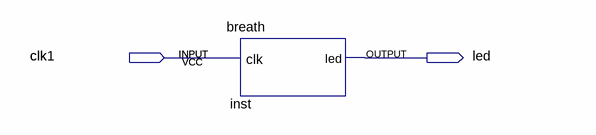
[diagram p0: schematic sheet]
// Quartus schematic Block5.bdf as structural Verilog: 1 symbols, 3 pins
module Block5 (
  input  clk,
  input  clk1,
  output led
);

  breath inst (.led(led));  // open: clk

  assign clk1 = clk;
endmodule
